# Altium schematic sheet rpi.SchDoc
size A4
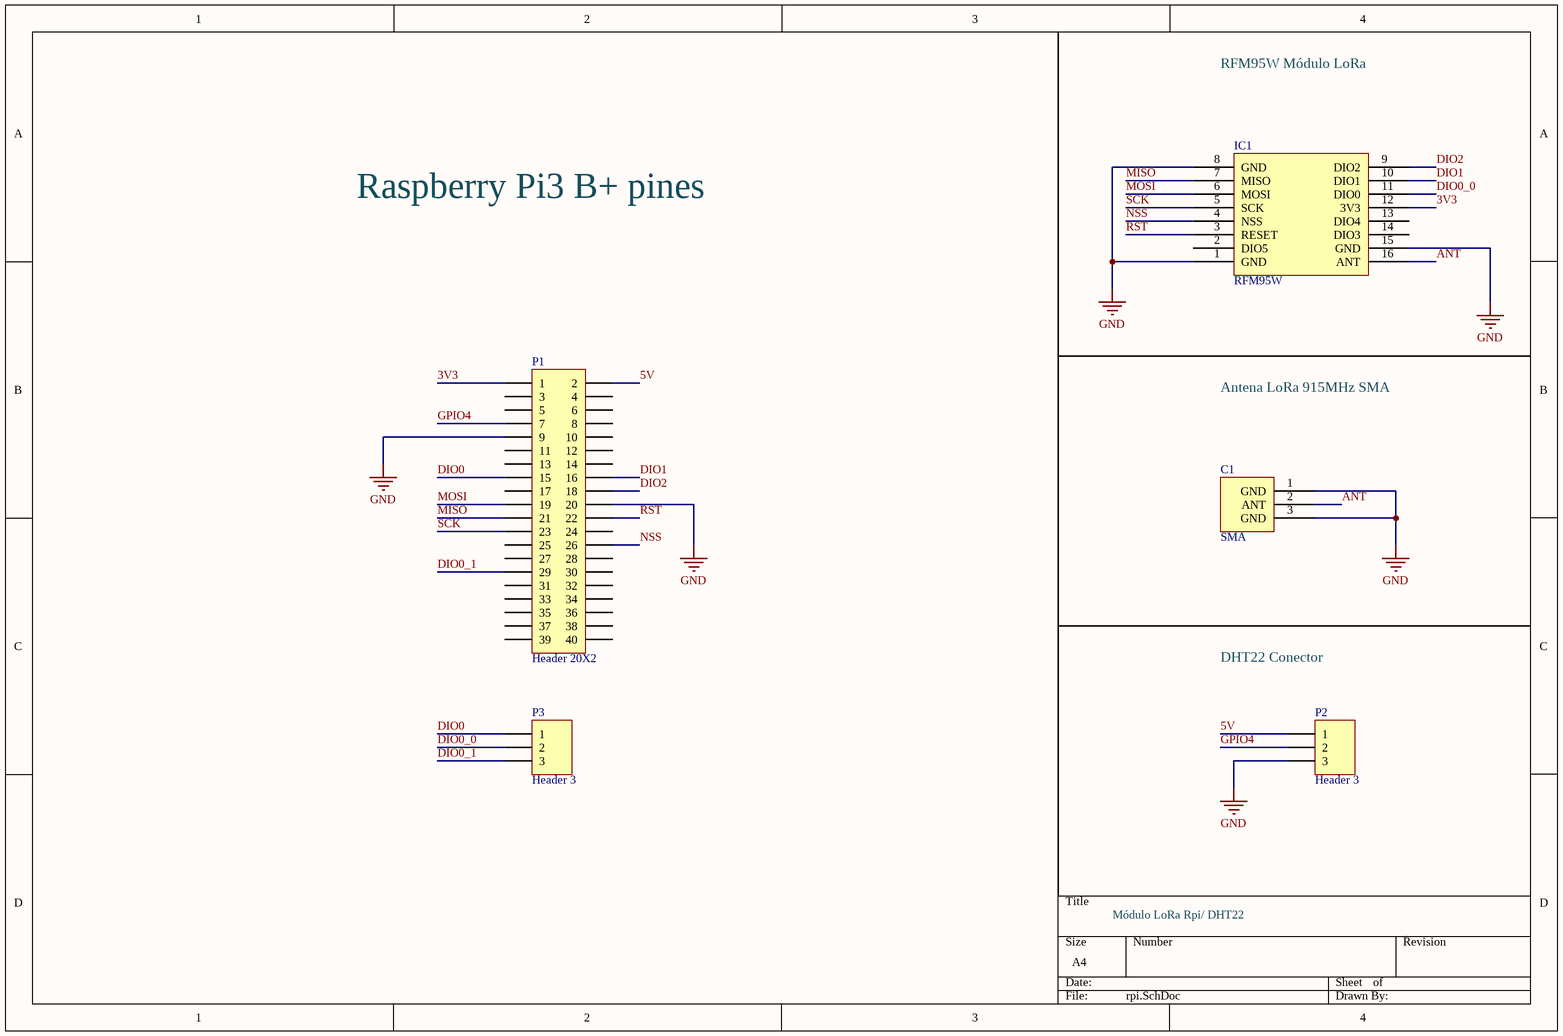
[diagram p0: rpi.SchDoc]

## Parts
C1  SMA  [SMA]
IC1  RFM95W  [RFM95W]
P1  Header 20X2  [HDR2X20]
P2  Header 3  [HDR1X3]
P3  Header 3  [HDR1X3]

## Nets
GND: C1.1(GND) C1.3(GND) IC1.1(GND) IC1.8(GND) IC1.15(GND) P1.9 P1.20 P2.3
3V3: IC1.12(3V3) P1.1
5V: P1.2 P2.1
ANT: C1.2(ANT) IC1.16(ANT)
DIO0: P1.15 P3.1
DIO0_0: IC1.11(DIO0) P3.2
DIO0_1: P1.29 P3.3
DIO1: IC1.10(DIO1) P1.16
DIO2: IC1.9(DIO2) P1.18
GPIO4: P1.7 P2.2
MISO: IC1.7(MISO) P1.21
MOSI: IC1.6(MOSI) P1.19
NSS: IC1.4(NSS) P1.26
RST: IC1.3(RESET) P1.22
SCK: IC1.5(SCK) P1.23

Not connected (* = marked no-connect by the designer): IC1 2(DIO5) 13(DIO4) 14(DIO3); P1 3 4 5 6 8 10 11 12 13 14 17 24 25 27 28 30 31 32 33 34 35 36 37 38 39 40

## Notes on the sheet
- RFM95W Módulo LoRa
- Raspberry Pi3 B+ pines
- Antena LoRa 915MHz SMA
- DHT22 Conector
- Módulo LoRa Rpi/ DHT22

## Library data of the parts
P1 = Header 20X2: Header, 20-Pin, Dual row; LatestRevisionDate: 17-Jul-2002; LatestRevisionNote: Re-released for DXP Platform.; Publisher: Altium Limited
P2 P3 = Header 3: Header, 3-Pin; LatestRevisionDate: 17-Jul-2002; LatestRevisionNote: Re-released for DXP Platform.; Publisher: Altium Limited